# Altium schematic sheet STM32Disc1-Interface.SchDoc: STM32 DISCOVERY 407
size Letter; ApprovedBy: APPROUVÉ PAR; Organization: Cegep Limoilou; Address1: 1300, 8e Avenue; Address2: Québec, QC; Address3: Canada; Address4: G1J 5L5; SheetNumber: 3; SheetTotal: 8
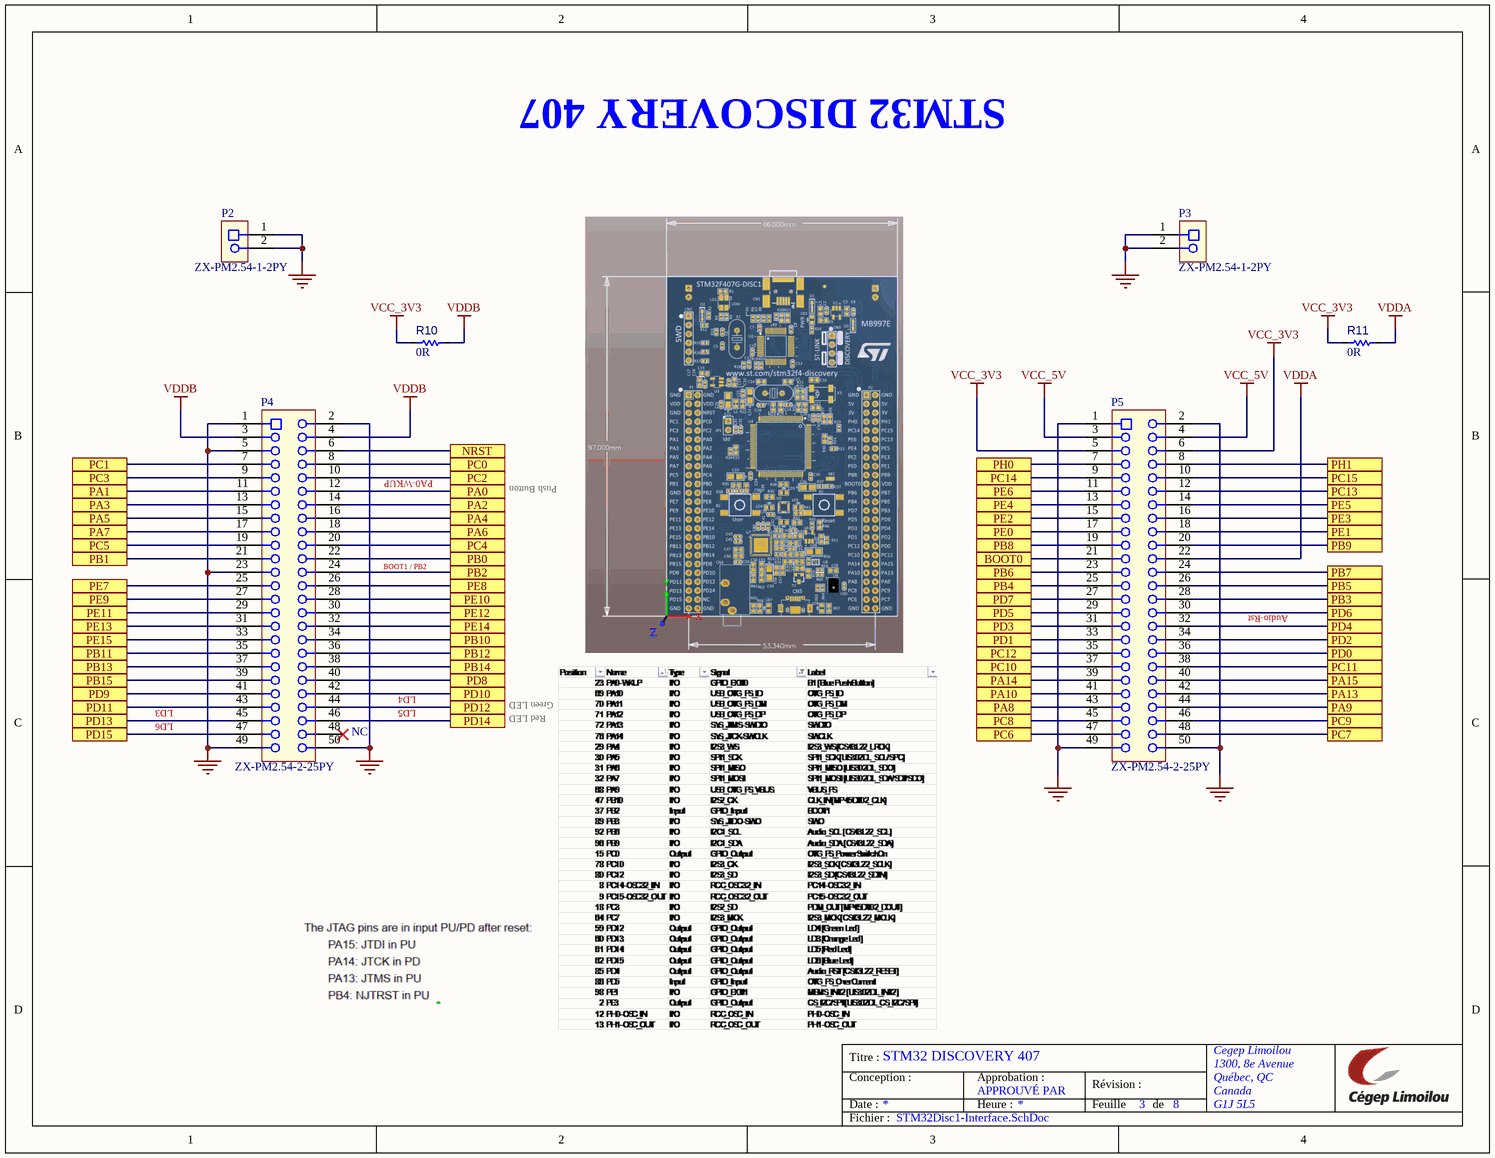
[diagram p0: STM32Disc1-Interface.SchDoc]

## Parts
P2  ZX-PM2.54-1-2PY  [CONN_SKT_2POS_100MILS_TH]
P3  ZX-PM2.54-1-2PY  [CONN_SKT_2POS_100MILS_TH]
P4  ZX-PM2.54-2-25PY  [CONN-HEAD02X25-100MIL]
P5  ZX-PM2.54-2-25PY  [CONN-HEAD02X25-100MIL]
R10  value 0R  [R_1005[0402]]  (hidden comment: Res 0R 0402)
R11  value 0R  [R_1005[0402]]  (hidden comment: Res 0R 0402)

## Ports
BOOT0 (see PCB-Support-STM32F407[2A]), NRST (see PCB-Support-STM32F407[2A]), PA0 (see PCB-Support-STM32F407[2A]), PA1 (see PCB-Support-STM32F407[2A]), PA2 (see PCB-Support-STM32F407[2A]), PA3 (see PCB-Support-STM32F407[2B]), PA4 (see PCB-Support-STM32F407[2B]), PA5 (see PCB-Support-STM32F407[2B]), PA6 (see PCB-Support-STM32F407[2B]), PA7 (see PCB-Support-STM32F407[2B]), PA8 (see PCB-Support-STM32F407[2B]), PA9 (see PCB-Support-STM32F407[2B]), PA10 (see PCB-Support-STM32F407[2B]), PA13 (see PCB-Support-STM32F407[2B]), PA14 (see PCB-Support-STM32F407[2B]), PA15 (see PCB-Support-STM32F407[2B]), PB0 (see PCB-Support-STM32F407[2B]), PB1 (see PCB-Support-STM32F407[2B]), PB2 (see PCB-Support-STM32F407[2B]), PB3 (see PCB-Support-STM32F407[2B]), PB4 (see PCB-Support-STM32F407[2B]), PB5 (see PCB-Support-STM32F407[2B]), PB6 (see PCB-Support-STM32F407[2B]), PB7 (see PCB-Support-STM32F407[2C]), PB8 (see PCB-Support-STM32F407[2C]), PB9 (see PCB-Support-STM32F407[2C]), PB10 (see PCB-Support-STM32F407[2C]), PB11 (see PCB-Support-STM32F407[2C]), PB12 (see PCB-Support-STM32F407[2C]), PB13 (see PCB-Support-STM32F407[2C]), PB14 (see PCB-Support-STM32F407[2C]), PB15 (see PCB-Support-STM32F407[2C]), PC0 (see PCB-Support-STM32F407[2C]), PC1 (see PCB-Support-STM32F407[2C]), PC2 (see PCB-Support-STM32F407[2C]), PC3 (see PCB-Support-STM32F407[2C]), PC4 (see PCB-Support-STM32F407[2C]), PC5 (see PCB-Support-STM32F407[2C]), PC6 (see PCB-Support-STM32F407[2C]), PC7 (see PCB-Support-STM32F407[2C]), PC8 (see PCB-Support-STM32F407[1A]), PC9 (see PCB-Support-STM32F407[1A]), PC10 (see PCB-Support-STM32F407[1A]), PC11 (see PCB-Support-STM32F407[1A]), PC12 (see PCB-Support-STM32F407[1A]), PC13 (see PCB-Support-STM32F407[1B]), PC14 (see PCB-Support-STM32F407[1B]), PC15 (see PCB-Support-STM32F407[1B]), PD0 (see PCB-Support-STM32F407[1B]), PD1 (see PCB-Support-STM32F407[1B]), PD2 (see PCB-Support-STM32F407[1B]), PD3 (see PCB-Support-STM32F407[1B]), PD4 (see PCB-Support-STM32F407[1B]), PD5 (see PCB-Support-STM32F407[1B]), PD6 (see PCB-Support-STM32F407[1B]), PD7 (see PCB-Support-STM32F407[1B]), PD8 (see PCB-Support-STM32F407[1B]), PD9 (see PCB-Support-STM32F407[1B]), PD10 (see PCB-Support-STM32F407[1B]), PD11 (see PCB-Support-STM32F407[1B]), PD12 (see PCB-Support-STM32F407[1B]), PD13 (see PCB-Support-STM32F407[1B]), PD14 (see PCB-Support-STM32F407[1B]), PD15 (see PCB-Support-STM32F407[1B]), PE0 (see PCB-Support-STM32F407[1C]), PE1 (see PCB-Support-STM32F407[1C]), PE2 (see PCB-Support-STM32F407[1C]), PE3 (see PCB-Support-STM32F407[1C]), PE4 (see PCB-Support-STM32F407[1C]), PE5 (see PCB-Support-STM32F407[1C]), PE6 (see PCB-Support-STM32F407[1C]), PE7 (see PCB-Support-STM32F407[1C]), PE8 (see PCB-Support-STM32F407[1C]), PE9 (see PCB-Support-STM32F407[1C]), PE10 (see PCB-Support-STM32F407[1C]), PE11 (see PCB-Support-STM32F407[1C]), PE12 (see PCB-Support-STM32F407[1C]), PE13 (see PCB-Support-STM32F407[1C]), PE14 (see PCB-Support-STM32F407[1C]), PE15 (see PCB-Support-STM32F407[1C]), PH0 (see PCB-Support-STM32F407[1C]), PH1 (see PCB-Support-STM32F407[1C])

## Nets
GND: P2.1 P2.2 P3.1 P3.2 P4.1 P4.2 P4.5 P4.23 P4.49 P4.50 P5.1 P5.2 P5.49 P5.50
VCC_3V3: P5.5 P5.6 R10.1 R11.1
VCC_5V: P5.3 P5.4
VDDA: P5.22 R11.2
VDDB: P4.3 P4.4 R10.2
BOOT0: P5.21 ; port BOOT0
NRST: P4.6 ; port NRST
PA0: P4.12 ; port PA0
PA1: P4.11 ; port PA1
PA2: P4.14 ; port PA2
PA3: P4.13 ; port PA3
PA4: P4.16 ; port PA4
PA5: P4.15 ; port PA5
PA6: P4.18 ; port PA6
PA7: P4.17 ; port PA7
PA8: P5.43 ; port PA8
PA9: P5.44 ; port PA9
PA10: P5.41 ; port PA10
PA13: P5.42 ; port PA13
PA14: P5.39 ; port PA14
PA15: P5.40 ; port PA15
PB0: P4.22 ; port PB0
PB1: P4.21 ; port PB1
PB2: P4.24 ; port PB2
PB3: P5.28 ; port PB3
PB4: P5.25 ; port PB4
PB5: P5.26 ; port PB5
PB6: P5.23 ; port PB6
PB7: P5.24 ; port PB7
PB8: P5.19 ; port PB8
PB9: P5.20 ; port PB9
PB10: P4.34 ; port PB10
PB11: P4.35 ; port PB11
PB12: P4.36 ; port PB12
PB13: P4.37 ; port PB13
PB14: P4.38 ; port PB14
PB15: P4.39 ; port PB15
PC0: P4.8 ; port PC0
PC1: P4.7 ; port PC1
PC2: P4.10 ; port PC2
PC3: P4.9 ; port PC3
PC4: P4.20 ; port PC4
PC5: P4.19 ; port PC5
PC6: P5.47 ; port PC6
PC7: P5.48 ; port PC7
PC8: P5.45 ; port PC8
PC9: P5.46 ; port PC9
PC10: P5.37 ; port PC10
PC11: P5.38 ; port PC11
PC12: P5.35 ; port PC12
PC13: P5.12 ; port PC13
PC14: P5.9 ; port PC14
PC15: P5.10 ; port PC15
PD0: P5.36 ; port PD0
PD1: P5.33 ; port PD1
PD2: P5.34 ; port PD2
PD3: P5.31 ; port PD3
PD4: P5.32 ; port PD4
PD5: P5.29 ; port PD5
PD6: P5.30 ; port PD6
PD7: P5.27 ; port PD7
PD8: P4.40 ; port PD8
PD9: P4.41 ; port PD9
PD10: P4.42 ; port PD10
PD11: P4.43 ; port PD11
PD12: P4.44 ; port PD12
PD13: P4.45 ; port PD13
PD14: P4.46 ; port PD14
PD15: P4.47 ; port PD15
PE0: P5.17 ; port PE0
PE1: P5.18 ; port PE1
PE2: P5.15 ; port PE2
PE3: P5.16 ; port PE3
PE4: P5.13 ; port PE4
PE5: P5.14 ; port PE5
PE6: P5.11 ; port PE6
PE7: P4.25 ; port PE7
PE8: P4.26 ; port PE8
PE9: P4.27 ; port PE9
PE10: P4.28 ; port PE10
PE11: P4.29 ; port PE11
PE12: P4.30 ; port PE12
PE13: P4.31 ; port PE13
PE14: P4.32 ; port PE14
PE15: P4.33 ; port PE15
PH0: P5.7 ; port PH0
PH1: P5.8 ; port PH1

Not connected (* = marked no-connect by the designer): P4 48*

## Notes on the sheet
- PA0-WKUP
- Push Button
- BOOT1 / PB2
- Audio-Rst
- LD4
- Green LED
- LD3
- LD6
- (near P4) NC
- LD5
- Red LED
- Titre :
- Conception :
- Date :
- Approbation :
- Heure :
- Révision :
- Feuille
- de
- Fichier :

## Library data of the parts
P2 P3 = CONN-100MIL-SKT-01X02: CONN SOCKET 2pins single row , 100mils TH; Manufacturer 1: Megastar; Manufacturer Part Number 1: ZX-PM2.54-1-2PY; Mounting Technology: TH; Supplier 1: LCSC; Supplier Part Number 1: C7499322; Manufacturer 2: Würth Elektronik; Manufacturer Part Number 2: 61300211121
P4 P5 = CONN-100MIL-SKT-02X25: CONN SOCKET 2x25POS, Dual row 100MIL; Manufacturer 1: Megastar; Manufacturer Part Number 1: ZX-PM2.54-2-25PY; Mounting Technology: TH; Manufacturer 2: Sullins; Manufacturer Part Number 2: SFH11-PBPC-D25-ST-BK; Supplier 1: LCSC; Supplier 2: Digikey; Supplier Part Number 1: C7499355; Supplier Part Number 2: S9201-ND
R10 R11 = RES005: Resistor type 1; Manufacturer 1: Yageo; Manufacturer Part Number 1: RC0402JR-070RL; LibRef: RES005; Max Working Voltage: 50V; Mounting Technology: SMT; Supplier 1: LCSC; Supplier Part Number 1: C60485